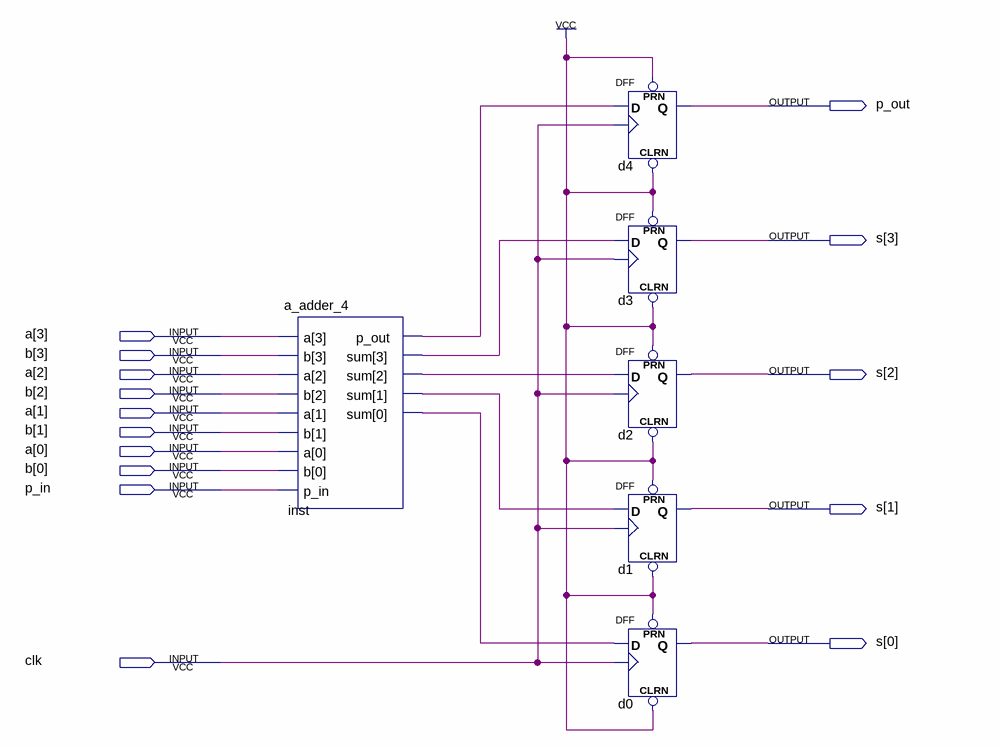
[diagram p0: schematic sheet]
// Quartus schematic c_adder_4.bdf as structural Verilog: 6 symbols, 15 pins
module c_adder_4 (
  input  [3:0] a,
  input  [3:0] b,
  input  p_in,
  input  clk,
  output p_out,
  output [3:0] s
);

  wire inst_p_out, inst_sum, inst_sum_2, inst_sum_3, inst_sum_4;

  a_adder_4 inst (.a(a), .b(b), .p_in(p_in), .p_out(inst_p_out), .sum({inst_sum_2, inst_sum_4, inst_sum, inst_sum_3}));
  DFF d4 (.CLRN(1'b1), .CLK(clk), .D(inst_p_out), .PRN(1'b1), .Q(p_out));
  DFF d3 (.CLRN(1'b1), .CLK(clk), .D(inst_sum_2), .PRN(1'b1), .Q(s[3]));
  DFF d2 (.CLRN(1'b1), .CLK(clk), .D(inst_sum_4), .PRN(1'b1), .Q(s[2]));
  DFF d1 (.CLRN(1'b1), .CLK(clk), .D(inst_sum), .PRN(1'b1), .Q(s[1]));
  DFF d0 (.CLRN(1'b1), .CLK(clk), .D(inst_sum_3), .PRN(1'b1), .Q(s[0]));
endmodule
